# Altium schematic sheet BioTempSch.SchDoc
size A4; SheetNumber: 1; SheetTotal: 1
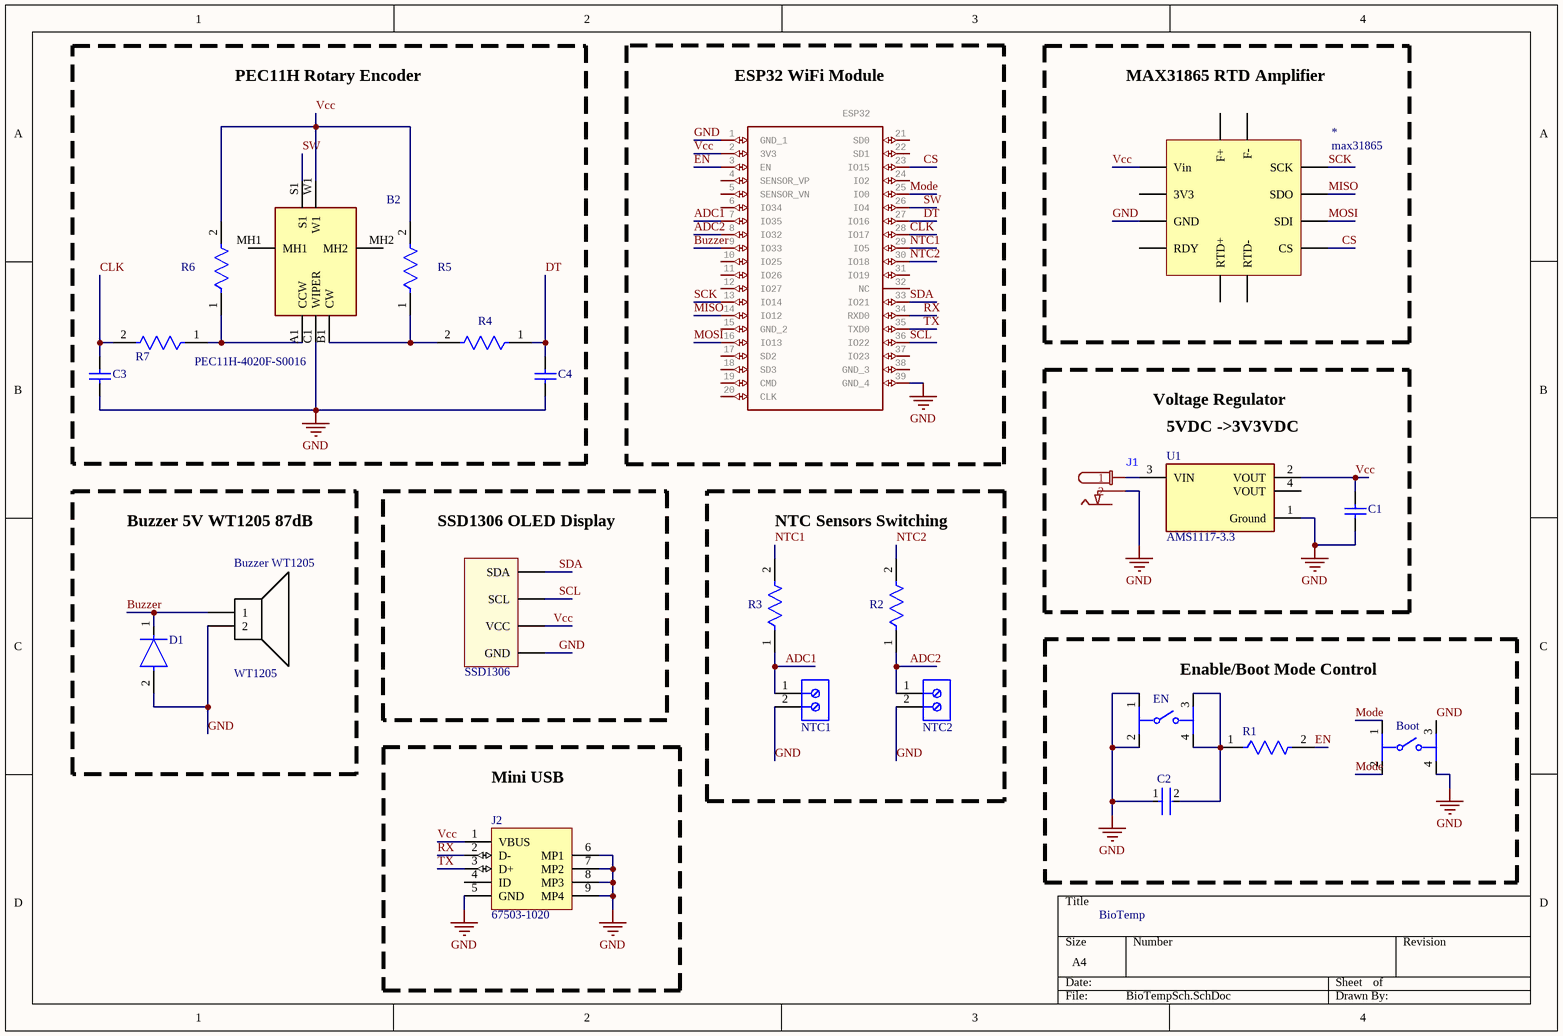
[diagram p0: BioTempSch.SchDoc]

## Parts
*  max31865  [max31865]
B2  PEC11H-4020F-S0016  [PEC11H4020FS0016]
Boot  B3F-1070  [FP-B3F-1070-MFG]  (value not drawn)
Buzzer_WT1205  WT1205  [WT1205]
C1  C0805C103K5RACTU  [CAPC2013X88X50LL20T25]  (value not drawn)
C2  C0603C104M4RACTU  [FP-C0603C-CF-MFG]  (value not drawn)
C3  C0805C103K5RACTU  [CAPC2013X88X50LL20T25]  (value not drawn)
C4  C0805C103K5RACTU  [CAPC2013X88X50LL20T25]  (value not drawn)
D1  1N4007 SMD  [FP-1N4007_SMD-IPC_C]  (value not drawn)
EN  B3F-1070  [FP-B3F-1070-MFG]  (value not drawn)
ESP32  WiFi Modules (802.11) SMD Module, ESP32-D0WD, 32Mbits SPI flash, UART mode, PCB antenna   Source:  Datasheet  [ESP32WROOM32D]  (value not drawn)
J1  (no value)  [P4 JACK]
J2  67503-1020  [MOLX-67503-1020_V]
NTC1  691213710002  [691213710002]  (value not drawn)
NTC2  691213710002  [691213710002]  (value not drawn)
R1  RC0603FR-0710KL  [FP-RC0603-0_55-IPC_C]  (value not drawn)
R2  RC0603FR-0710KL  [FP-RC0603-0_55-IPC_C]  (value not drawn)
R3  RC0603FR-0710KL  [FP-RC0603-0_55-IPC_C]  (value not drawn)
R4  RC0603FR-0710KL  [FP-RC0603-0_55-IPC_C]  (value not drawn)
R5  RC0603FR-0710KL  [FP-RC0603-0_55-IPC_C]  (value not drawn)
R6  RC0603FR-0710KL  [FP-RC0603-0_55-IPC_C]  (value not drawn)
R7  RC0603FR-0710KL  [FP-RC0603-0_55-IPC_C]  (value not drawn)
SSD1306  SSD1306  [SSD1306]  (value not drawn)
U1  AMS1117-3.3  [FP-AMS1117-IPC_C]

## Blocks framed on the sheet
PEC11H Rotary Encoder: B2 C3 C4 R4-R7
ESP32 WiFi Module: ESP32
MAX31865 RTD Amplifier: *
Buzzer 5V WT1205 87dB: Buzzer_WT1205 D1
SSD1306 OLED Display: SSD1306
NTC Sensors Switching: NTC1 NTC2 R2 R3
Enable/Boot Mode Control: Boot C2 EN R1
Mini USB: J2

## Nets
GND: *.2(GND) B2.C1(WIPER) Boot.3 Boot.4 Buzzer_WT1205.2 C1.1 C2.1 C3.1 C4.1 D1.2(A) EN.1 EN.2 ESP32.1(GND_1) ESP32.39(GND_4) J1.2 J2.5(GND) J2.6(MP1) J2.7(MP2) J2.8(MP3) J2.9(MP4) NTC1.2 NTC2.2 SSD1306.0(GND) U1.1(Ground)
ADC1: ESP32.7(IO35) NTC1.1 R3.1
ADC2: ESP32.8(IO32) NTC2.1 R2.1
Buzzer: Buzzer_WT1205.1 D1.1(C) ESP32.9(IO33)
CLK: C3.2 ESP32.28(IO17) R7.2
CS: *.7(CS) ESP32.23(IO15)
DT: C4.2 ESP32.27(IO16) R4.1
EN: ESP32.3(EN) R1.2
MISO: *.5(SDO) ESP32.14(IO12)
Mode: Boot.1 Boot.2 ESP32.25(IO0)
MOSI: *.6(SDI) ESP32.16(IO13)
NTC1: ESP32.29(IO5) R3.2
NTC2: ESP32.30(IO18) R2.2
RX: ESP32.34(RXD0) J2.2(D-)
SCK: *.4(SCK) ESP32.13(IO14)
SCL: ESP32.36(IO22) SSD1306.2(SCL)
SDA: ESP32.33(IO21) SSD1306.3(SDA)
SW: B2.S1 ESP32.26(IO4)
TX: ESP32.35(TXD0) J2.3(D+)
Vcc: *.1(Vin) B2.W1 C1.2 ESP32.2(3V3) J2.1(VBUS) R5.2 R6.2 SSD1306.1(VCC) U1.2(VOUT)
NetB2_A1: B2.A1(CCW) R6.1 R7.1
NetB2_B1: B2.B1(CW) R4.2 R5.1
NetC2_2: C2.2 EN.3 EN.4 R1.1
NetJ1_1: J1.1 U1.3(VIN)

Not connected (* = marked no-connect by the designer): * 3(3V3) 8(RDY) 9(RTD+) 10(RTD-) 11(F+) 12(F-); B2 MH1 MH2; ESP32 4(SENSOR_VP) 5(SENSOR_VN) 6(IO34) 10(IO25) 11(IO26) 12(IO27) 15(GND_2) 17(SD2) 18(SD3) 19(CMD) 20(CLK) 21(SD0) 22(SD1) 24(IO2) 31(IO19) 32(NC) 37(IO23) 38(GND_3); J2 4(ID); U1 4(VOUT)

## Notes on the sheet
- Voltage Regulator
- (near U1) 5VDC ->3V3VDC
- BioTemp

## Library data of the parts
B2 = PEC11H-4020F-S0016: Encoders ROTARY ENCODER W/BALL SPRING; Manufacturer_Name: Bourns; Geometry.Height: 27mm; Mouser Part Number: 652-PEC11H4020FS0016; Mouser Price/Stock: https://www.mouser.co.uk/ProductDetail/Bourns/PEC11H-4020F-S0016?qs=7MVldsJ5Uaz%252B8OdHRKxgZA%3D%3D; Manufacturer_Part_Number: PEC11H-4020F-S0016; Datasheet Link: https://componentsearchengine.com/Datasheets/2/PEC11H-4020F-S0016.pdf
Boot EN = CMP-08834-000056-1: SWITCH TACTILE SPST-NO 0.05A 24V; Number of Poles: 1; Actuator Color: Black; Contact Current Rating: 50mA; Contact Resistance: 100mR; Switch Function: Off-Mom; Operating Force: 0.98N; Actuator Length: 6.1mm; Electrical Life: 1000000Cycles; Throw Configuration: SPST; Switch Travel: 0.25mm; Actuator Type: Standard; Illumination Type: Non-Illuminated; Mechanical Life: 500000Cycles; Orientation: Straight; Max Operating Temperature: 70°C; Mount: Through Hole; Packaging: Bulk; Contact Material: Gold; Package Quantity: 1000; Max Voltage Rating (DC): 24V; Max Current Rating: 50mA; Lead Free: Lead Free; Min Operating Temperature: -25°C; Length: 6mm; RoHS Compliant: Yes; Depth: 7.7mm; Current Rating: 50mA; Contact Plating: Silver; Termination: PC Pins; Voltage Rating (DC): 24V; Insulation Resistance: 100MR; Series: B3F; Weight: 0.25g
Buzzer_WT1205 = WT1205: Buzzer WT1205 87dB 5V
C1 C3 C4 = CMP-2007-00266-1: Manufacturer: Kemet; Part Number: C0805C103K5RACTU
C2 = CMP-2006-03067-2: CAP CER 0.1UF 16V X7R 0603; Manufacturer: KEMET; Temperature Coefficient: 30ppm/°C; Value: 0.10 μF; Tolerance: 0.2; Material: Ceramic; Automotive Grade: Grade 1; Temperature Range Low: -55°C; Manufacturer Part Number: C0603C104M4RACTU; ComponentLink2Description: Datasheet; Mouser Description: Multilayer Ceramic Capacitors MLCC - SMD/SMT 16volts 0.1uF X7R 20%; ComponentLink2URL: https://api.kemet.com/component-edge/download/datasheet/C0603C100J5GACAUTO.pdf; Device Class L2: Capacitors; Automotive: Yes; Capacitance: 0.10 μF; Temperature Range High: +125°C; Voltage Rating: 16 V; Lead Free: Yes; Temperature Characteristic: X7R; Package: C0603C-CF; RoHS: TRUE; Device Class L1: Passive Components; Temperature: -55°C to +125°C; Digikey Description: CAP CER 0.1UF 16V X7R 0603; Category: Cap; Device Class L3: Ceramic Capacitors; Octopart: https://octopart.com/c0603c104m4ractu-kemet-134275; Height: 0.87mm
D1 = CMP-12389-000001-1: Rectifier, 1Kv, 1A, Do-214Ac Rohs Compliant: Yes
ESP32 = ESP32-WROOM-32D: Manufacturer_Name: Espressif Systems; GateName_1: G$1; SymbolName_1: ESP32-WROOM-32D; LibraryName: ESP32-WROOM-32D; DeviceSetName: ESP32-WROOM-32D; Package: ESP32WROOM32D; Manufacturer_Part_Number: ESP32-WROOM-32D; Mouser_Part_Number: N/A; Mouser_Price-Stock: https://www.mouser.co.uk/ProductDetail/Espressif-Systems/ESP32-WROOM-32D?qs=MLItCLRbWszx2KabkKPu5A%3D%3D; Height: 3.1mm
J1 = POWER JACK P4
J2 = CMP-0411-00002-1: USB, MINI, SMD, RA KME04-USBMU03A01; Manufacturer: Molex; ComponentLink1URL: http://www.molex.com/; PartNumber: 67503-1020; Mounting Technology: Surface Mount; ComponentLink1Description: Manufacturer URL; Terminal Pitch: 0.8 mm; DatasheetVersion: Rev F, 06/2009; ComponentLink2Description: Datasheet; PackageDescription: Mini USB Connector, SMT, Righer Angle; ComponentLink2URL: http://www.molex.com/pdm_docs/sd/675031020_sd.pdf; PackageReference: 67503-1020
NTC1 NTC2 = CMP-1502-02526-2: NexarPartId: 8917718; Number of Contacts: 2; Current Rating: 10A; Stripping Length: -7mm; Wire Gauge (Max): 26AWG; Plating: Brass, Steel; Wire Gauge (Min): 16AWG; Voltage: 300V; Number of Levels: 1; Pitch: 5.0038mm; Color: Green; Number of Pins: 2; Housing Material: Nylon; Termination: Screw; Max Operating Temperature: 105°C; Min Operating Temperature: -40°C; Packaging: Box; Current: 10A; REACH SVHC: Unknown; Width: 10.6mm; RoHS: Compliant; Mount: Through Hole; Height: 10mm; Contact Material: Brass; Length: 8.3mm; Lead Pitch: 5mm; Wire/Cable Gauge: 26AWG; Voltage Rating: 300V; Number of Positions Per Level: 2; Contact Plating: Tin
R1-R7 = CMP-2100-03664-2: RES 10K OHM 1% 1/10W 0603; Voltage Rating: 75V; Voltage Rating (DC): 50V; Resistance: 10kR; Power Rating: 100mW; Temperature Coefficient: 100ppm/°C; Depth: 0.8mm; Termination: SMD/SMT; Resistor Type: Thick Film; Series: RC; Construction: Rectangular; Features: Moisture Resistant; Packaging: Tape and Reel; Min Operating Temperature: -55°C; Number of Terminations: 2; Lead Pitch: 0.3mm; RoHS Compliant: Yes; Case/Package: 0603; Resistance Tolerance: 1%; Military Standard: Not; Weight: 7.1E-05oz; Number of Pins: 2; Tolerance: 1%; Length: 1.6mm; Case Code (Imperial): 0603; Lead Free: Lead Free; Width: 0.8mm; Max Power Dissipation: 100mW; Height: 0.45mm; Max Operating Temperature: 155°C; Case Code (Metric): 1608; Size Code: 0603
SSD1306 = SSD1306: SSD1306 OLED Display 1280x64
U1 = CMP-209535-000001-1: LDO Voltage Regulators 1A, 3.3V; Manufacturer: Advanced Monolithic Systems; Dropout Voltage: 1.1V; Output Type: Fixed; Nominal Supply Current: 5mA; Max Power Dissipation: 1.2W; Max Supply Voltage: 15V; Number Of Outputs: 1; Standoff Height: 0.64mm; Max Junction Temp: +125°C; Height: 1.8mm; Package: AMS1117; Device Class L2: Power Management ICs; ComponentLink2Description: Datasheet; ComponentLink2URL: http://www.advanced-monolithic.com/pdf/ds1117.pdf; Category: IC; RoHS: TRUE; Automotive: No; Device Class L1: Integrated Circuits (ICs); Output Current: 1A; Device Class L3: Voltage Regulators - Linear; Temperature: -40°C to +125°C; Output Voltage: 3.3V; Manufacturer Part Number: AMS1117-3.3; Temperature Range Low: -40°C; Octopart: https://octopart.com/ams1117-3.3-advanced+monolithic+systems-25899300; Lead Free: Yes; Ipc Land Pattern Name: SOT229P700X180-4; Temperature Range High: +125°C